# Altium schematic sheet Sheet1.SchDoc
size A4; SheetNumber: 1; SheetTotal: 1
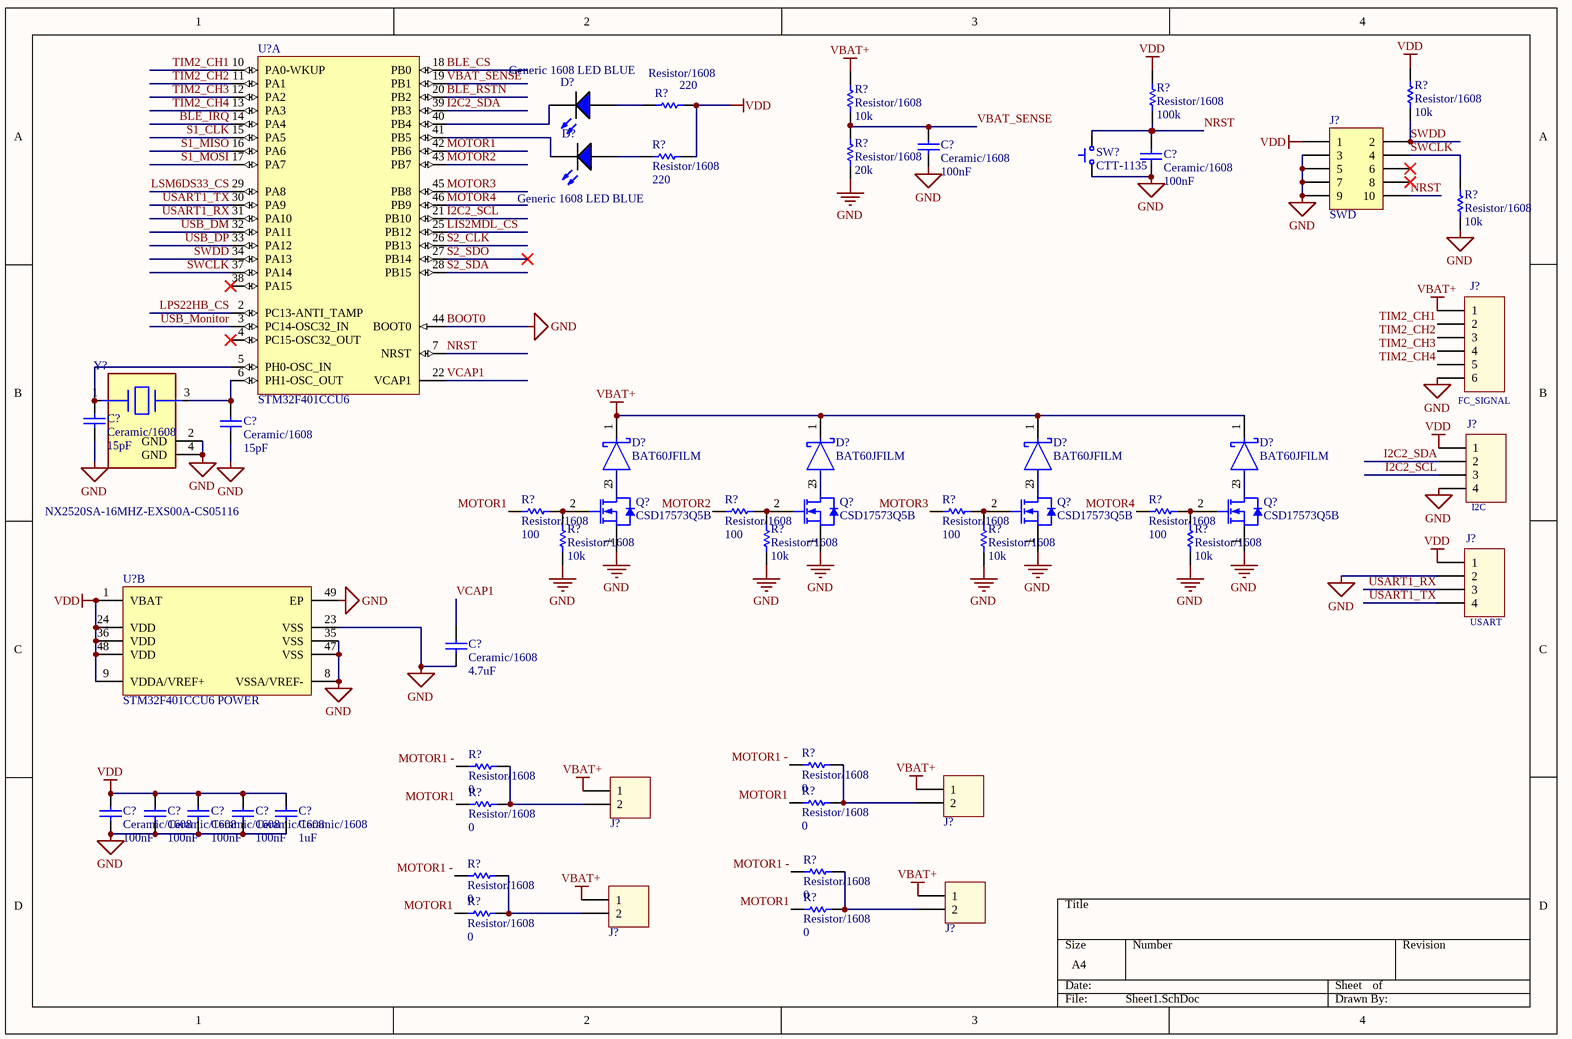
[diagram p0: Sheet1.SchDoc]

## Parts
(Parts that share a designator on the sheet are numbered #1, #2 ... from top to bottom, then left to right.)
C?#1  Ceramic/1608  value 100nF  [Generic 1608 Ceramic]
C?#2  Ceramic/1608  value 100nF  [Generic 1608 Ceramic]
C?#3  Ceramic/1608  value 15pF  [Generic 1608 Ceramic]
C?#4  Ceramic/1608  value 15pF  [Generic 1608 Ceramic]
C?#5  Ceramic/1608  value 4.7uF  [Generic 1608 Ceramic]
C?#6  Ceramic/1608  value 100nF  [Generic 1608 Ceramic]
C?#7  Ceramic/1608  value 100nF  [Generic 1608 Ceramic]
C?#8  Ceramic/1608  value 100nF  [Generic 1608 Ceramic]
C?#9  Ceramic/1608  value 100nF  [Generic 1608 Ceramic]
C?#10  Ceramic/1608  value 1uF  [Generic 1608 Ceramic]
D?#1  Generic 1608 LED BLUE  [Generic 1608 LED BLUE-Footprint-1]
D?#2  Generic 1608 LED BLUE  [Generic 1608 LED BLUE-Footprint-1]
D?#3  BAT60JFILM  [FP-BAT60JFILM-MFG]
D?#4  BAT60JFILM  [FP-BAT60JFILM-MFG]
D?#5  BAT60JFILM  [FP-BAT60JFILM-MFG]
D?#6  BAT60JFILM  [FP-BAT60JFILM-MFG]
J?#1  SWD  [3220-10-0300-00-Footprint-1]
J?#2  FC_SIGNAL  [61300611121]
J?#3  I2C  [61300411121]
J?#4  USART  [61300411121]
J?#5  61300211121  [61300211121]  (value not drawn)
J?#6  61300211121  [61300211121]  (value not drawn)
J?#7  61300211121  [61300211121]  (value not drawn)
J?#8  61300211121  [61300211121]  (value not drawn)
Q?#1  CSD17573Q5B  [CSD16342Q5A-Footprint-1]
Q?#2  CSD17573Q5B  [CSD16342Q5A-Footprint-1]
Q?#3  CSD17573Q5B  [CSD16342Q5A-Footprint-1]
Q?#4  CSD17573Q5B  [CSD16342Q5A-Footprint-1]
R?#1  Resistor/1608  value 220  [Resistor 1608-Footprint]
R?#2  Resistor/1608  value 10k  [Resistor 1608-Footprint]
R?#3  Resistor/1608  value 100k  [Resistor 1608-Footprint]
R?#4  Resistor/1608  value 10k  [Resistor 1608-Footprint]
R?#5  Resistor/1608  value 220  [Resistor 1608-Footprint]
R?#6  Resistor/1608  value 20k  [Resistor 1608-Footprint]
R?#7  Resistor/1608  value 10k  [Resistor 1608-Footprint]
R?#8  Resistor/1608  value 100  [Resistor 1608-Footprint]
R?#9  Resistor/1608  value 100  [Resistor 1608-Footprint]
R?#10  Resistor/1608  value 100  [Resistor 1608-Footprint]
R?#11  Resistor/1608  value 100  [Resistor 1608-Footprint]
R?#12  Resistor/1608  value 10k  [Resistor 1608-Footprint]
R?#13  Resistor/1608  value 10k  [Resistor 1608-Footprint]
R?#14  Resistor/1608  value 10k  [Resistor 1608-Footprint]
R?#15  Resistor/1608  value 10k  [Resistor 1608-Footprint]
R?#16  Resistor/1608  value 0  [Resistor 1608-Footprint]
R?#17  Resistor/1608  value 0  [Resistor 1608-Footprint]
R?#18  Resistor/1608  value 0  [Resistor 1608-Footprint]
R?#19  Resistor/1608  value 0  [Resistor 1608-Footprint]
R?#20  Resistor/1608  value 0  [Resistor 1608-Footprint]
R?#21  Resistor/1608  value 0  [Resistor 1608-Footprint]
R?#22  Resistor/1608  value 0  [Resistor 1608-Footprint]
R?#23  Resistor/1608  value 0  [Resistor 1608-Footprint]
SW?  CTT-1135  [CTT-1135-Footprint-1]
U?#1  STM32F401CCU6  [STM-UFQFPN48_N]  (part A of 2)
U?#2  STM32F401CCU6 POWER  [STM-UFQFPN48_N]  (part B of 2)
Y?  NX2520SA-16MHZ-EXS00A-CS05116  [FP-NX2520SA-MFG]

## Nets
BOOT0: C?#1.1 C?#2.1 C?#3.1 C?#4.1 C?#5.1 C?#6.1 C?#7.1 C?#8.1 C?#9.1 C?#10.1 J?#1.3 J?#1.5 J?#1.7 J?#1.9 J?#2.6 J?#3.4 J?#4.2 Q?#1.1(S) Q?#2.1(S) Q?#3.1(S) Q?#4.1(S) R?#6.1 R?#7.1 R?#12.1 R?#13.1 R?#14.1 R?#15.1 SW?.1 U?#1.44(BOOT0) U?#2.8(VSSA/VREF-) U?#2.23(VSS) U?#2.35(VSS) U?#2.47(VSS) U?#2.49(EP) Y?.2(GND) Y?.4(GND)  [also labelled GND]
VBAT+: D?#3.1(K) D?#4.1(K) D?#5.1(K) D?#6.1(K) J?#2.1 J?#5.1 J?#6.1 J?#7.1 J?#8.1 R?#2.2
VDD: C?#6.2 C?#7.2 C?#8.2 C?#9.2 C?#10.2 J?#1.1 J?#3.1 J?#4.1 R?#1.2 R?#3.2 R?#4.2 R?#5.2 U?#2.1(VBAT) U?#2.9(VDDA/VREF+) U?#2.24(VDD) U?#2.36(VDD) U?#2.48(VDD)
BLE_CS: U?#1.18(PB0)
BLE_IRQ: U?#1.14(PA4)
BLE_RSTN: U?#1.20(PB2)
I2C2_SCL: J?#3.3 U?#1.21(PB10)
I2C2_SDA: J?#3.2 U?#1.39(PB3)
LIS2MDL_CS: U?#1.25(PB12)
LPS22HB_CS: U?#1.2(PC13-ANTI_TAMP)
LSM6DS33_CS: U?#1.29(PA8)
MOTOR1: R?#8.1 R?#18.1 R?#19.1 R?#22.1 R?#23.1 U?#1.42(PB6)
MOTOR1 -: R?#16.1 R?#17.1 R?#20.1 R?#21.1
MOTOR2: R?#9.1 U?#1.43(PB7)
MOTOR3: R?#10.1 U?#1.45(PB8)
MOTOR4: R?#11.1 U?#1.46(PB9)
NRST: C?#2.2 J?#1.10 R?#3.1 SW?.2 U?#1.7(NRST)
S1_CLK: U?#1.15(PA5)
S1_MISO: U?#1.16(PA6)
S1_MOSI: U?#1.17(PA7)
S2_CLK: U?#1.26(PB13)
S2_SDA: U?#1.28(PB15)
S2_SDO: U?#1.27(PB14)
SWCLK: J?#1.4 R?#7.2 U?#1.37(PA14)
SWDD: J?#1.2 R?#4.1 U?#1.34(PA13)
TIM2_CH1: J?#2.2 U?#1.10(PA0-WKUP)
TIM2_CH2: J?#2.3 U?#1.11(PA1)
TIM2_CH3: J?#2.4 U?#1.12(PA2)
TIM2_CH4: J?#2.5 U?#1.13(PA3)
USART1_RX: J?#4.3 U?#1.31(PA10)
USART1_TX: J?#4.4 U?#1.30(PA9)
USB_DM: U?#1.32(PA11)
USB_DP: U?#1.33(PA12)
USB_Monitor: U?#1.3(PC14-OSC32_IN)
VBAT_SENSE: C?#1.2 R?#2.1 R?#6.2 U?#1.19(PB1)
VCAP1: C?#5.2 U?#1.22(VCAP1)
NetC?#3_2: C?#3.2 U?#1.5(PH0-OSC_IN) Y?.1
NetC?#4_2: C?#4.2 U?#1.6(PH1-OSC_OUT) Y?.3
NetD?#1_1: D?#1.1(A) R?#1.1
NetD?#1_2: D?#1.2(K) U?#1.40(PB4)
NetD?#2_1: D?#2.1(A) R?#5.1
NetD?#2_2: D?#2.2(K) U?#1.41(PB5)
NetD?#3_2: D?#3.2(A) Q?#1.3(D)
NetD?#4_2: D?#4.2(A) Q?#2.3(D)
NetD?#5_2: D?#5.2(A) Q?#3.3(D)
NetD?#6_2: D?#6.2(A) Q?#4.3(D)
NetJ?#5_2: J?#5.2 R?#16.2 R?#18.2
NetJ?#6_2: J?#6.2 R?#17.2 R?#19.2
NetJ?#7_2: J?#7.2 R?#21.2 R?#22.2
NetJ?#8_2: J?#8.2 R?#20.2 R?#23.2
NetQ?#1_2: Q?#1.2(G) R?#8.2 R?#12.2
NetQ?#2_2: Q?#2.2(G) R?#9.2 R?#13.2
NetQ?#3_2: Q?#3.2(G) R?#10.2 R?#14.2
NetQ?#4_2: Q?#4.2(G) R?#11.2 R?#15.2

Not connected (* = marked no-connect by the designer): J?#1 6* 8*; U?#1 4(PC15-OSC32_OUT)* 38(PA15)*

## Library data of the parts
C?#1-C?#10 = CMP-002-0009-3: Generic 1608 Ceramic Capacitor; Capacitor Type: Ceramic; Pins: 2; Mount: SMD; Case/Package: 1608; RoHS: Yes
D?#1 D?#2 = CMP-008-0003-2: Generic 1608 LED <BLUE>
D?#3-D?#6 = CMP-12187-000028-1: DIODE SCHOTTKY 10V 3A SOD323; Max Forward Surge Current (Ifsm): 5A; Forward Voltage: 580mV; Max Reverse Leakage Current: 7.5uA; Element Configuration: Single; Polarity: Standard; Output Current: 3A; Contact Plating: Tin; Package Quantity: 1; Mount: Surface Mount; Min Operating Temperature: -65°C; Average Rectified Current: 3A; Packaging: Tape and Reel; Forward Current: 3A; Height: 1.07mm; Length: 1.8mm; REACH SVHC: No SVHC; Peak Non-Repetitive Surge Current: 5A; Max Surge Current: 5A; Width: 1.45mm; Current Rating: 3A; Lead Free: Lead Free; Radiation Hardening: No; Max Reverse Voltage (DC): 10V; Peak Reverse Current: 7.5uA; Voltage Rating (DC): 10V; Max Operating Temperature: 150°C; Max Repetitive Reverse Voltage (Vrrm): 10V; Number of Pins: 2; Weight: 0.01lb
J?#1 = CMP-ROOT-00062-1: CONN HEADER SMD 10POS 1.27MM; Pitch: 0.05inch; Number of Positions: 10; Connector Type: Male Pin; Mount: Surface Mount; Packaging: Tray; Contact Plating: Gold; Termination: Solder; Number of Rows: 2; RoHS: Yes; Package Quantity: 3200; Row Spacing: 0.05inch
J?#2 = CMP-005-0062-1: Pin Header WR-PHD, pitch 2.54 mm, THT, Vertical, single row, 6 pin; Contact Resistance: 20 mOhm; Insulation Resistance: >1000 MOhm; Pin Number: 6; Pitch: 2.54 mm; Rated Current: 3 A; Working Voltage: 250 VAC; Component Name: 61300611121; ComponentLink1Description: Manufacturer; ComponentLink1URL: http://www.we-online.de; ComponentLink2Description: Datasheet; ComponentLink2URL: http://katalog.we-online.de/em/datasheet/6130xx11121.pdf; Designator: 61300611121; Mounting Technology: THT; Operating Temperature: -40 to 105 degC; Orientation: Vertical; Part Number: 61300611121; Pin Count: 6; Published Date: Jan. 2018; Publisher: Wurth Elektronik; Row Number: Single
J?#3 J?#4 = CMP-005-0056-1: Pin Header WR-PHD, pitch 2.54 mm, THT, Vertical, single row, 4 pin; Contact Resistance: 20 mOhm; Insulation Resistance: >1000 MOhm; Pin Number: 4; Pitch: 2.54 mm; Rated Current: 3 A; Working Voltage: 250 VAC; Component Name: 61300411121; ComponentLink1Description: Manufacturer; ComponentLink1URL: http://www.we-online.de; ComponentLink2Description: Datasheet; ComponentLink2URL: http://katalog.we-online.de/em/datasheet/6130xx11121.pdf; Designator: 61300411121; Mounting Technology: THT; Operating Temperature: -40 to 105 degC; Orientation: Vertical; Part Number: 61300411121; Pin Count: 4; Published Date: Jan. 2018; Publisher: Wurth Elektronik; Row Number: Single
J?#5-J?#8 = CMP-005-0052-1: Pin Header WR-PHD, pitch 2.54 mm, THT, Vertical, single row, 2 pin; Contact Resistance: 20 mOhm; Insulation Resistance: >1000 MOhm; Pin Number: 2; Pitch: 2.54 mm; Rated Current: 3 A; Working Voltage: 250 VAC; Component Name: 61300211121; ComponentLink1Description: Manufacturer; ComponentLink1URL: http://www.we-online.de; ComponentLink2Description: Datasheet; ComponentLink2URL: http://katalog.we-online.de/em/datasheet/6130xx11121.pdf; Designator: 61300211121; Mounting Technology: THT; Operating Temperature: -40 to 105 degC; Orientation: Vertical; Part Number: 61300211121; Pin Count: 2; Published Date: Jan. 2018; Publisher: Wurth Elektronik; Row Number: Single
Q?#1-Q?#4 = CMP-014-0005-2: Trans MOSFET N-CH 30V 100A 8-Pin SON T/R; pin to pad: 1>1+2+3 2>4 3>5+6+7+8; Turn-On Delay Time: 6ns; Max Power Dissipation: 3.2W; Rds On Max: 1mR; Turn-Off Delay Time: 40ns; Gate to Source Voltage (Vgs): 20V; Input Capacitance: 9nF; Element Configuration: Single; Rise Time: 20ns; Fall Time: 7ns; Max Operating Temperature: 150°C; Contact Plating: Nickel, Gold; Mount: Surface Mount; Lead Free: Contains Lead; Number of Pins: 8; Drain to Source Voltage (Vdss): 30V; Continuous Drain Current (ID): 100A; Packaging: Tape and Reel; Min Operating Temperature: -55°C
R?#1-R?#23 = CMP-001-0018-2: Generic 1608 Resistor; Pins: 2; Case/Package: Bulk; RoHS: Yes; Mount: SMD
SW? = CMP-013-0003-1: 3.9x2.9x2.0 SMD  Tact switch; RoHS: Yes; Case/Package: 3.9x2.9x2.0; Mount: SMD; Pins: 2
U?#1 U?#2 = CMP-0243-00119-2: ARM Cortex-M4 32-bit MCU+FPU, 105 DMIPS, 256 kB Flash, 64 kB Internal RAM, 36 I/Os, 48-pin UFQFPN, -40 to 85 degC, Tray; Manufacturer: STMicroelectronics; Supply Voltage(Vcc) max (V): 3.6; I/Os (High Current): 36; Internal RAM Size (kB): 64; Operating Frequency(F) (Processor speed) (MHz): 84; FLASH Size (Prog) (kB): 256; Supply Voltage(Vcc) min (V): 1.8; Packing: Tray; PackageReference: UFQFPN48; PackageVersion: Rev. 1, 04/2013; Core: ARM Cortex-M4; ComponentLink1Description: Manufacturer URL; ComponentLink3Description: Package Specification; PackageDescription: 48-Pin Ultra Thin Fine Pitch Quad Flat No-Lead, 7 x 7 x 0.6 mm Body, 0.5 mm Pitch, Exposed Pad; Mounting Technology: Surface Mount; ComponentLink2URL: http://www.st.com/st-web-ui/static/active/en/resource/technical/document/data_brief/DM00071938.pdf; DatasheetVersion: Rev. 1; ComponentLink2Description: Datasheet; ComponentLink1URL: http://www.st.com/web/en/home.html; PartNumber: STM32F401CCU6; ComponentLink3URL: http://www.st.com/st-web-ui/static/active/en/resource/technical/document/data_brief/DM00071938.pdf
Y? = CMP-2000-05279-2: CRYSTAL 16.0000MHZ 12PF SMD; Series Resistance: 80R; Frequency: 16MHz; Frequency Tolerance: 15ppm; Frequency Stability: 25ppm; Mount: Surface Mount; Height: 0.022inch; Length: 0.098inch; ESR (Equivalent Series Resistance): 80R; Packaging: Tape and Reel; Min Operating Temperature: -40°C; Width: 0.079inch; Number of Pins: 4; Case/Package: SMD/SMT; Max Operating Temperature: 85°C; Load Capacitance: 12pF; Package Quantity: 3000